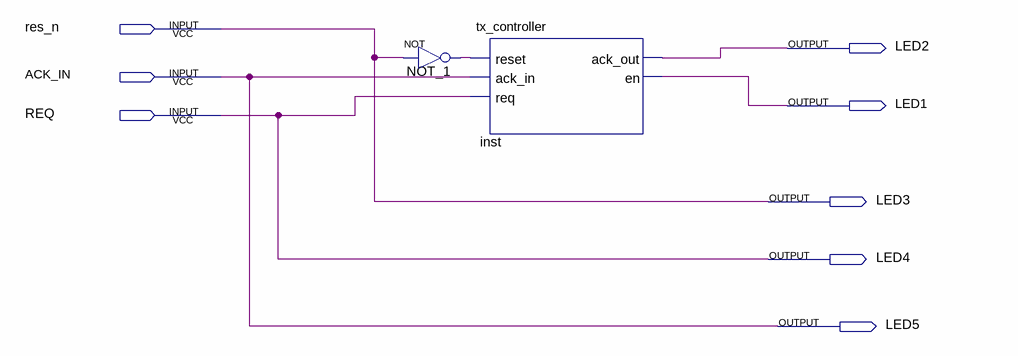
[diagram p0: schematic sheet]
// Quartus schematic test_controller.bdf as structural Verilog: 2 symbols, 8 pins
module test_controller (
  input  res_n,
  input  ACK_IN,
  input  REQ,
  output LED2,
  output LED1,
  output LED3,
  output LED4,
  output LED5
);

  wire NOT_1_out;

  not NOT_1 (NOT_1_out, res_n);
  tx_controller inst (.reset(NOT_1_out), .ack_in(ACK_IN), .req(REQ), .ack_out(LED2), .en(LED1));

  assign LED3 = res_n;
  assign LED4 = REQ;
  assign LED5 = ACK_IN;
endmodule
